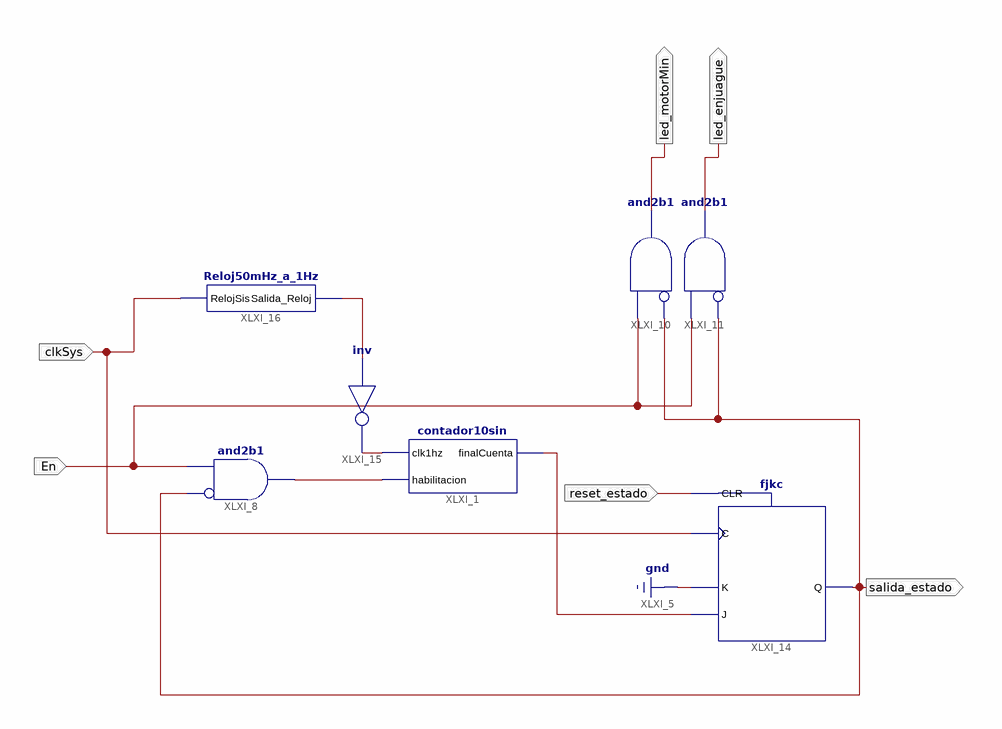
[diagram p0: schematic sheet 1]
// Xilinx ISE schematic enjuague.sch (spartan3e) as structural Verilog: 7 symbols, 6 ports
module enjuague (
  input  En,
  input  clkSys,
  input  reset_estado,
  output salida_estado,
  output led_motorMin,
  output led_enjuague
);

  wire salidareloj1hz, XLXN_3, XLXN_36, XLXN_41;

  contador10sin XLXI_1 (.clk1hz(salidareloj1hz), .habilitacion(XLXN_3), .finalCuenta(XLXN_36));
  and XLXI_8 (XLXN_3, ~salida_estado, En);  // and2b1
  and XLXI_10 (led_motorMin, ~salida_estado, En);  // and2b1
  and XLXI_11 (led_enjuague, ~salida_estado, En);  // and2b1
  fjkc XLXI_14 (.C(clkSys), .CLR(reset_estado), .J(XLXN_36), .K(1'b0), .Q(salida_estado));
  not XLXI_15 (salidareloj1hz, XLXN_41);
  Reloj50mHz_a_1Hz XLXI_16 (.RelojSis(clkSys), .Salida_Reloj(XLXN_41));
endmodule
